# EAGLE schematic master_wiring (EAGLE 9.6.2)
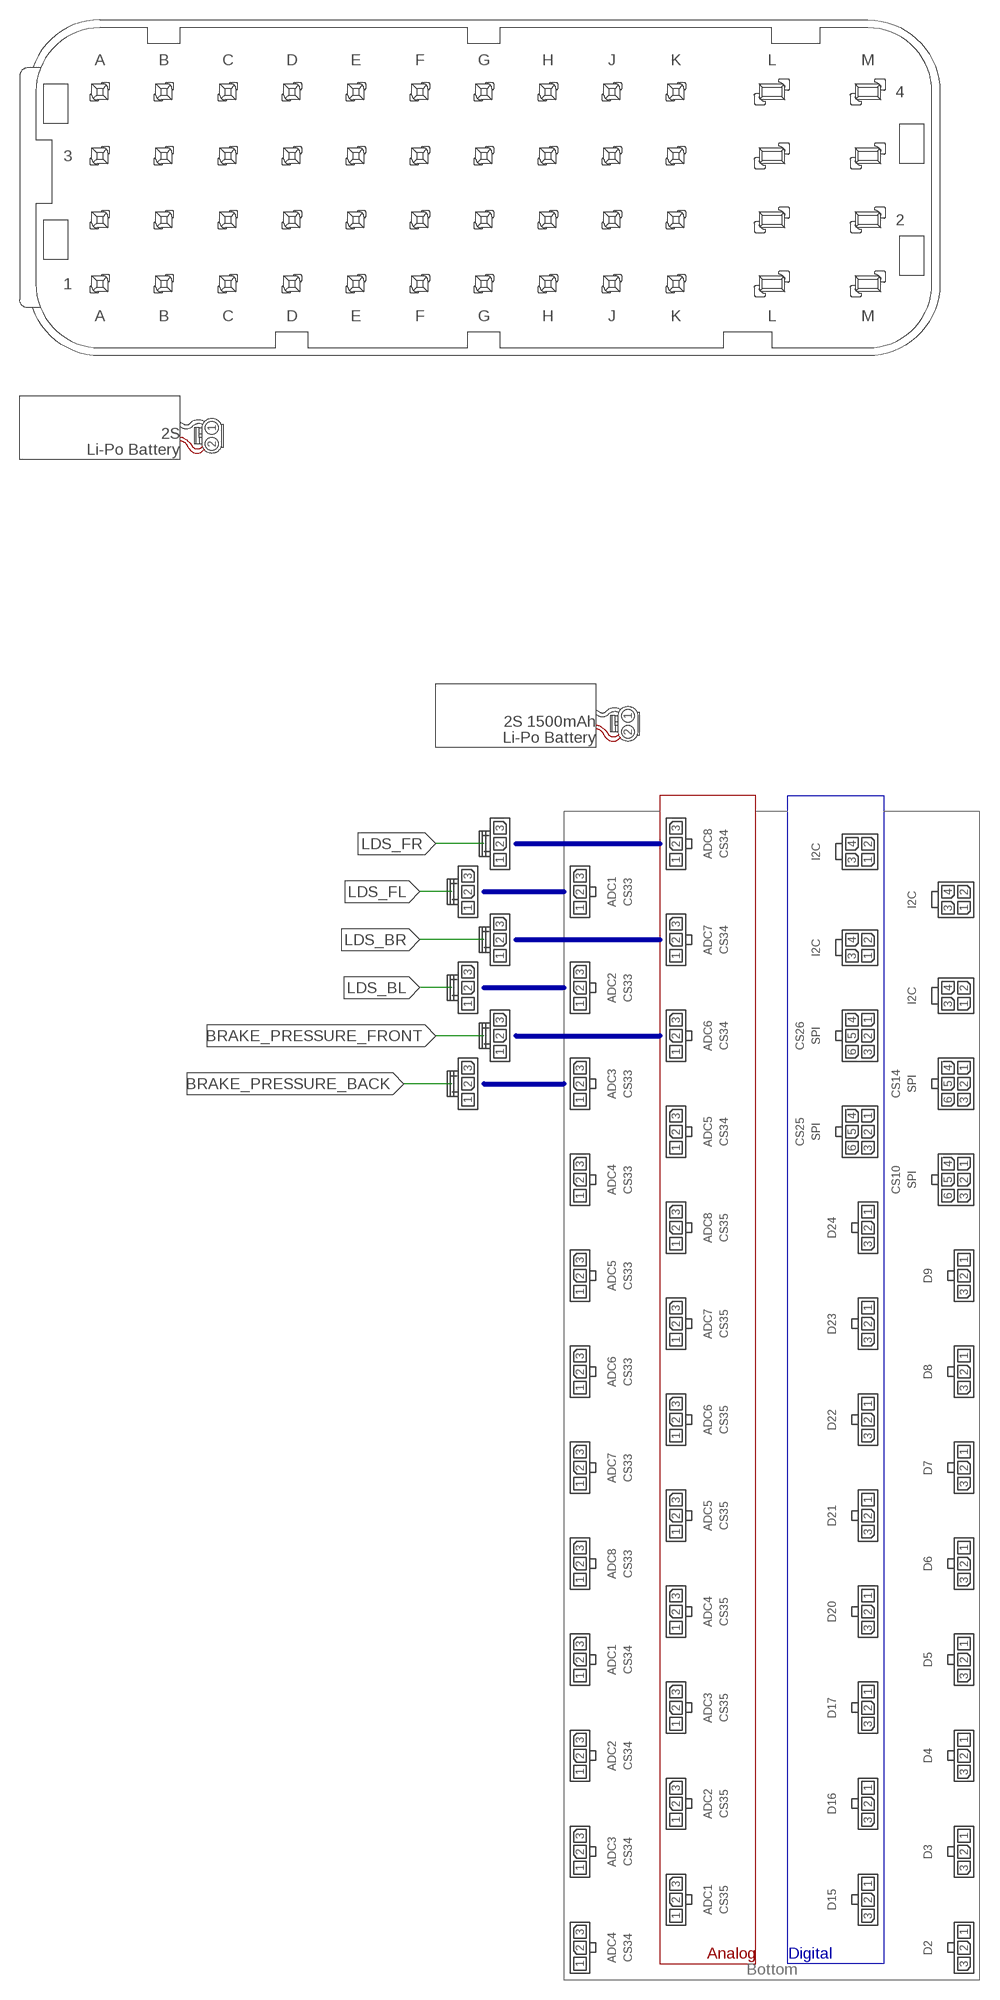
[diagram p0: schematic, sheet 1, part 1 of 2]
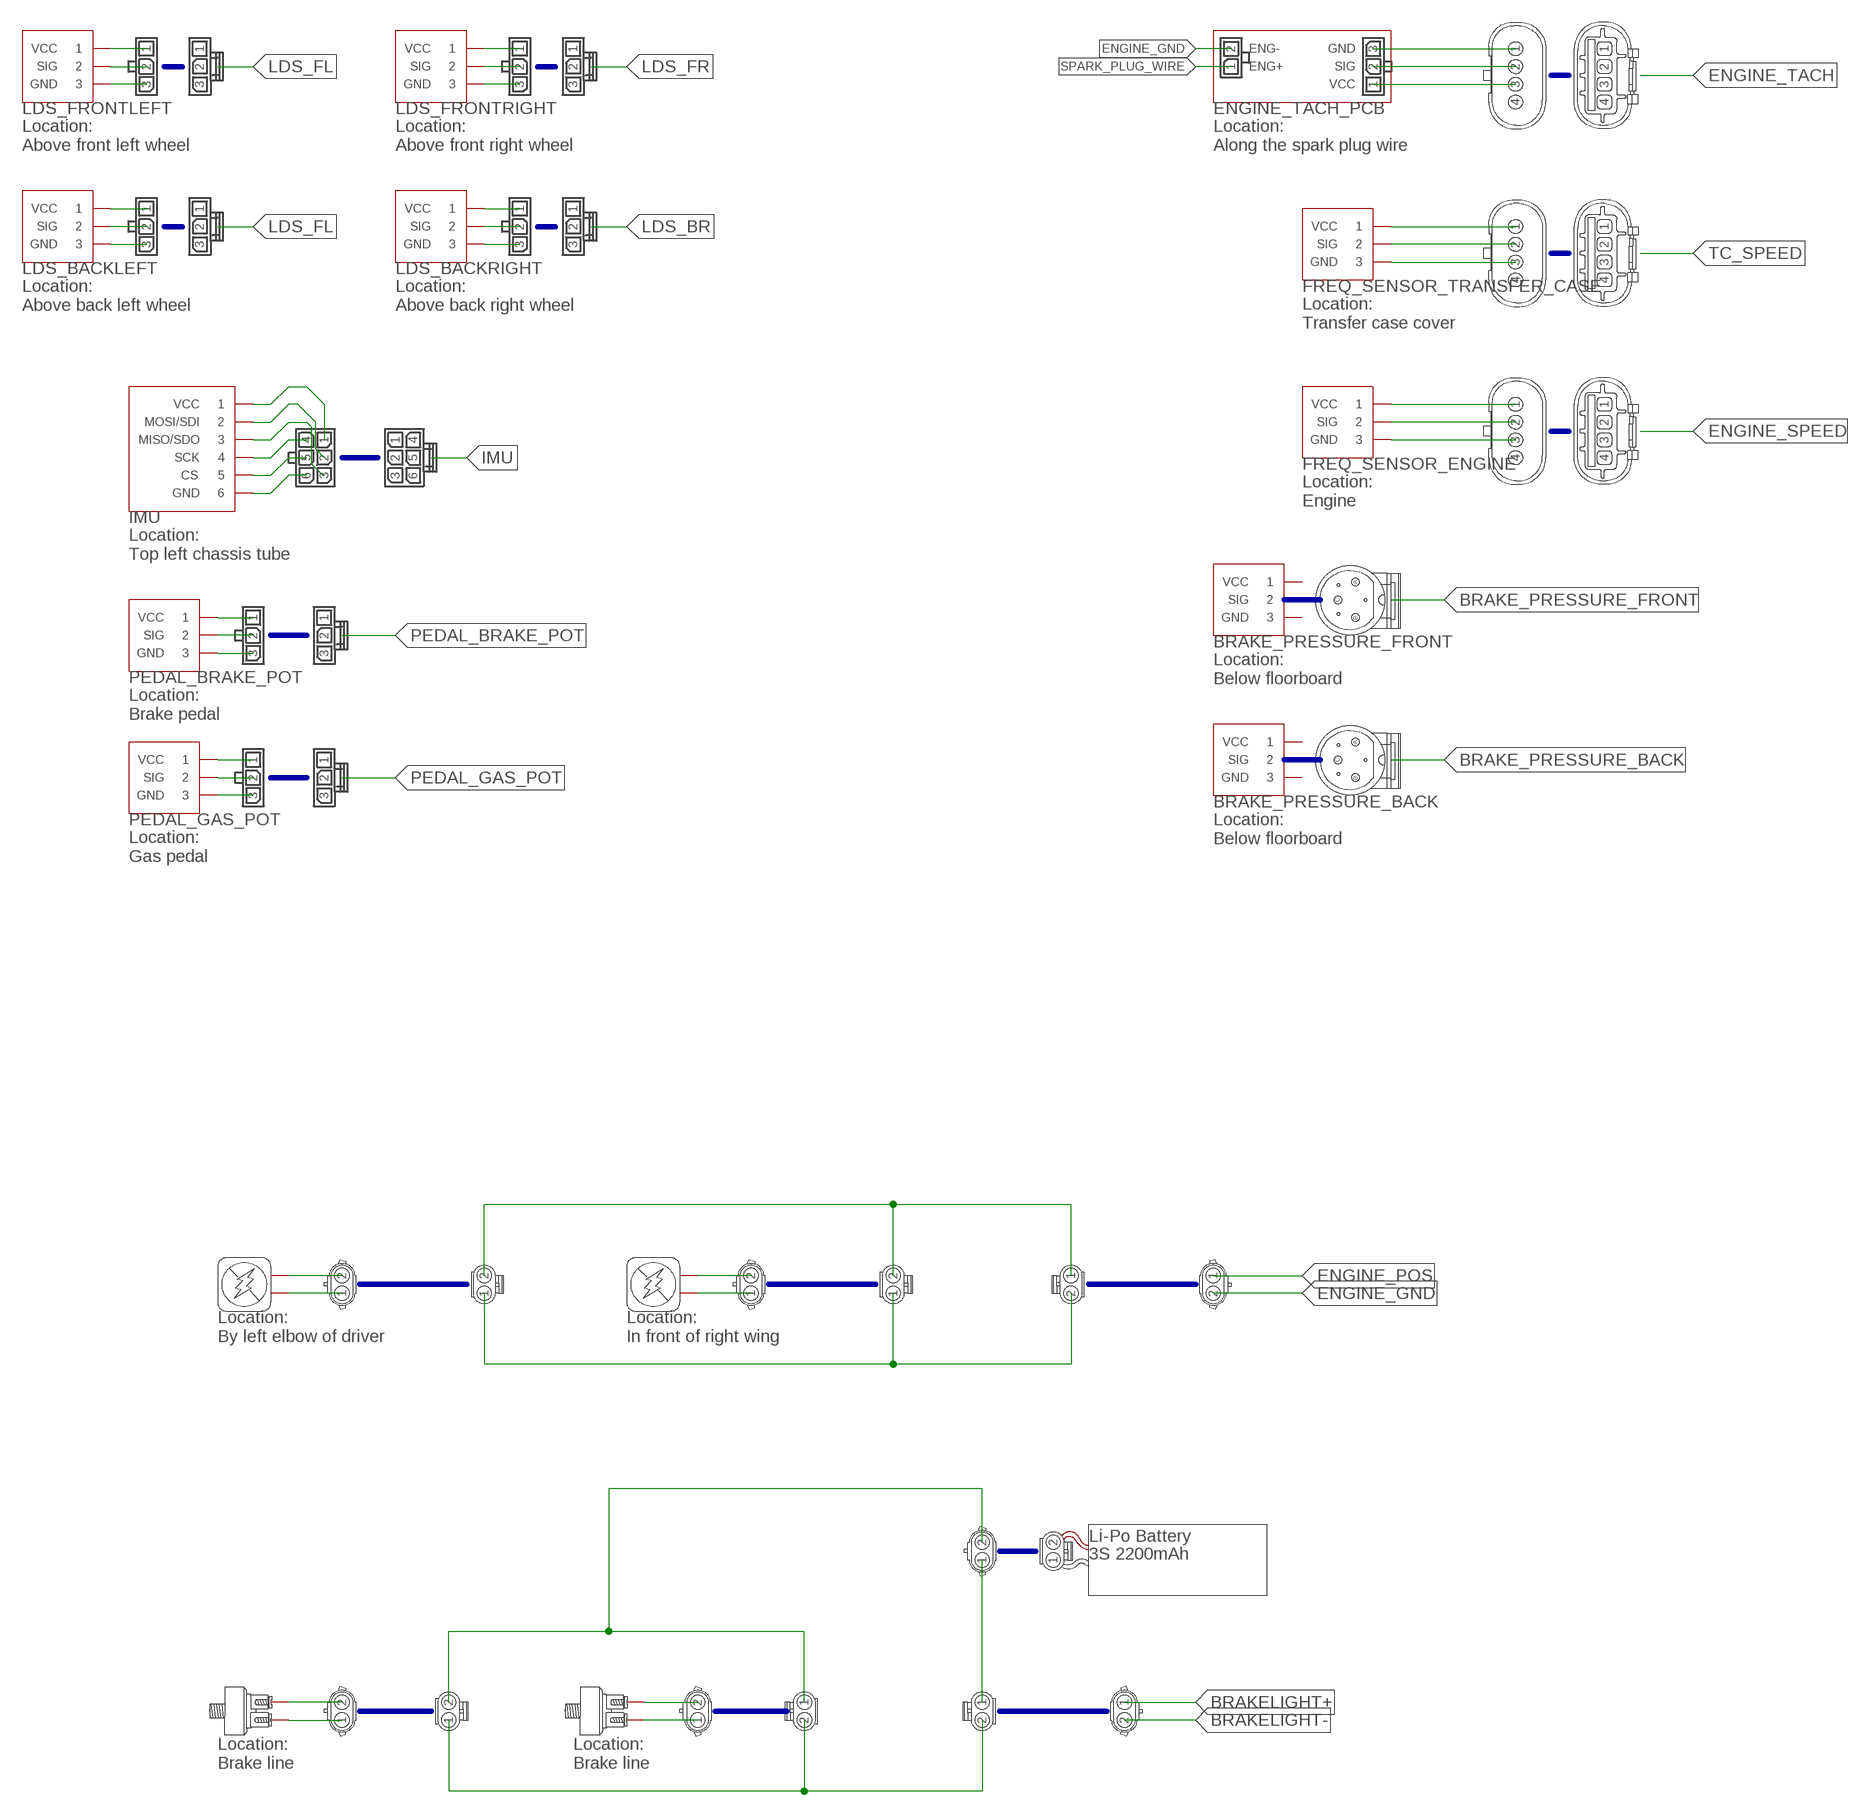
[diagram p1: schematic, sheet 1, part 2 of 2]

## Parts
BRAKE_PRESSURE_BACK  SENSOR_1X3  [PINS_3]
BRAKE_PRESSURE_FRONT  SENSOR_1X3  [PINS_3]
ENGINE_TACH_PCB  ENGINE_TACH_PCB  [PINS_7]
FREQ_SENSOR_ENGINE  SENSOR_1X3  [PINS_3]
FREQ_SENSOR_TRANSFER_CASE  SENSOR_1X3  [PINS_3]
IMU  SENSOR_SPI_2X3  [PINS_7]
LDS_BACKLEFT  SENSOR_1X3  [PINS_3]
LDS_BACKRIGHT  SENSOR_1X3  [PINS_3]
LDS_FRONTLEFT  SENSOR_1X3  [PINS_3]
LDS_FRONTRIGHT  SENSOR_1X3  [PINS_3]
PEDAL_BRAKE_POT  SENSOR_1X3  [PINS_3]
PEDAL_GAS_POT  SENSOR_1X3  [PINS_3]
U$1  MICROFIT_1X3_MALE  [PINS_4]
U$2  CMC_48PIN_PLUG_PCB  [PINS_49]
U$3  AUXDAQ_REV2  [PINS_200]
U$4  SKIDOO_KILLSWITCH  [PINS_3]
U$5  WEATHERPACK_1X2_MALE  [PINS_3]
U$6  WEATHERPACK_1X2_FEMALE  [PINS_3]
U$7  WEATHERPACK_1X2_MALE  [PINS_3]
U$8  WEATHERPACK_1X2_MALE  [PINS_3]
U$9  SKIDOO_KILLSWITCH  [PINS_3]
U$10  WEATHERPACK_1X2_FEMALE  [PINS_3]
U$11  WEATHERPACK_1X2_FEMALE  [PINS_3]
U$12  BRAKELIGHT_SWITCH_HYDRAULIC  [PINS_3]
U$13  WEATHERPACK_1X2_MALE  [PINS_3]
U$14  MICROFIT_1X3_MALE  [PINS_4]
U$15  WEATHERPACK_1X2_FEMALE  [PINS_3]
U$16  WEATHERPACK_1X2_MALE  [PINS_3]
U$17  WEATHERPACK_1X2_MALE  [PINS_3]
U$18  BRAKELIGHT_SWITCH_HYDRAULIC  [PINS_3]
U$19  WEATHERPACK_1X2_FEMALE  [PINS_3]
U$20  WEATHERPACK_1X2_FEMALE  [PINS_3]
U$21  MICROFIT_1X3_MALE  [PINS_4]
U$22  MICROFIT_1X3_MALE  [PINS_4]
U$23  MICROFIT_2X3_MALE  [PINS_7]
U$24  MICROFIT_1X3_MALE  [PINS_4]
U$25  MICROFIT_1X3_MALE  [PINS_4]
U$26  SQUBA_1X4_MALE  [PINS_5]
U$27  SQUBA_1X4_MALE  [PINS_5]
U$28  SQUBA_1X4_MALE  [PINS_5]
U$29  3S 2200mAh  LIPO_BATT  [PINS_200]
U$30  2S 1500mAh  LIPO_BATT  [PINS_200]
U$31  2S  LIPO_BATT  [PINS_200]
U$32  WEATHERPACK_1X2_MALE  [PINS_3]
U$33  MICROFIT_2X3_FEMALE  [PINS_7]
U$34  SQUBA_1X4_FEMALE  [PINS_5]
U$35  SQUBA_1X4_FEMALE  [PINS_5]
U$36  SQUBA_1X4_FEMALE  [PINS_5]
U$37  MICROFIT_1X3_FEMALE  [PINS_4]
U$38  MICROFIT_1X3_FEMALE  [PINS_4]
U$39  MICROFIT_1X3_FEMALE  [PINS_4]
U$40  MICROFIT_1X3_FEMALE  [PINS_4]
U$41  MICROFIT_1X3_FEMALE  [PINS_4]
U$42  MICROFIT_1X3_FEMALE  [PINS_4]
U$43  MICROFIT_1X3_FEMALE  [PINS_4]
U$44  MICROFIT_1X3_FEMALE  [PINS_4]
U$45  MICROFIT_1X3_FEMALE  [PINS_4]
U$46  MICROFIT_1X3_FEMALE  [PINS_4]
U$47  METRIPACK_3PIN_FEMALE  [PINS_3]
U$48  METRIPACK_3PIN_FEMALE  [PINS_3]
U$49  MICROFIT_1X3_FEMALE  [PINS_4]
U$50  MICROFIT_1X3_FEMALE  [PINS_4]

## Nets
B$1: IMU.P$1 IMU.P$2 IMU.P$3 IMU.P$4 IMU.P$5 IMU.P$6 U$23.P$1 U$23.P$2 U$23.P$3 U$23.P$4 U$23.P$5 U$23.P$6
BRAKELIGHT+: U$16.P$2
BRAKELIGHT-: U$16.P$1
ENGINE_GND: ENGINE_TACH_PCB.P$2 U$7.P$1
ENGINE_POS: U$7.P$2
N$1: U$4.P$2 U$5.P$1
N$2: U$4.P$1 U$5.P$2
N$3: U$8.P$1 U$9.P$2
N$4: U$8.P$2 U$9.P$1
N$5: U$12.P$2 U$17.P$2
N$6: U$12.P$1 U$17.P$1
N$7: U$13.P$1 U$18.P$1
N$8: U$13.P$2 U$18.P$2
N$9: PEDAL_GAS_POT.P$1 U$25.P$1
N$10: PEDAL_GAS_POT.P$2 U$25.P$2
N$11: U$6.P$2 U$10.P$2 U$11.P$1
N$12: PEDAL_GAS_POT.P$3 U$25.P$3
N$13: U$6.P$1 U$10.P$1 U$11.P$2
N$14: PEDAL_BRAKE_POT.P$1 U$24.P$1
N$15: PEDAL_BRAKE_POT.P$2 U$24.P$2
N$16: PEDAL_BRAKE_POT.P$3 U$24.P$3
N$17: LDS_BACKRIGHT.P$1 U$22.P$1
N$18: LDS_BACKRIGHT.P$2 U$22.P$2
N$19: LDS_BACKRIGHT.P$3 U$22.P$3
N$20: U$15.P$1 U$19.P$2 U$32.P$1
N$21: U$15.P$2 U$19.P$1 U$20.P$2
N$22: LDS_FRONTRIGHT.P$3 U$21.P$3
N$23: LDS_FRONTRIGHT.P$2 U$21.P$2
N$24: LDS_FRONTRIGHT.P$1 U$21.P$1
N$25: LDS_FRONTLEFT.P$1 U$1.P$1
N$26: LDS_FRONTLEFT.P$2 U$1.P$2
N$27: LDS_FRONTLEFT.P$3 U$1.P$3
N$28: LDS_BACKLEFT.P$1 U$14.P$1
N$29: LDS_BACKLEFT.P$2 U$14.P$2
N$30: LDS_BACKLEFT.P$3 U$14.P$3
N$31: FREQ_SENSOR_TRANSFER_CASE.P$1 U$28.P$1
N$32: FREQ_SENSOR_TRANSFER_CASE.P$2 U$28.P$2
N$33: FREQ_SENSOR_TRANSFER_CASE.P$3 U$28.P$3
N$34: FREQ_SENSOR_ENGINE.P$1 U$27.P$1
N$35: FREQ_SENSOR_ENGINE.P$2 U$27.P$2
N$36: FREQ_SENSOR_ENGINE.P$3 U$27.P$3
N$37: ENGINE_TACH_PCB.P$3 U$26.P$3
N$38: ENGINE_TACH_PCB.P$4 U$26.P$2
N$39: ENGINE_TACH_PCB.P$5 U$26.P$1
N$40: U$20.P$1 U$32.P$2
SPARK_PLUG_WIRE: ENGINE_TACH_PCB.P$1
Unconnected: BRAKE_PRESSURE_BACK.P$1 BRAKE_PRESSURE_BACK.P$2 BRAKE_PRESSURE_BACK.P$3 BRAKE_PRESSURE_FRONT.P$1 BRAKE_PRESSURE_FRONT.P$2 BRAKE_PRESSURE_FRONT.P$3 U$2.P$1(A1) U$2.P$2(A2) U$2.P$3(A3) U$2.P$4(A4) U$2.P$5(B1) U$2.P$6(B2) U$2.P$7(B3) U$2.P$8(B4) U$2.P$9(C1) U$2.P$10(C2) U$2.P$11(C3) U$2.P$12(C4) U$2.P$13(D1) U$2.P$14(D2) U$2.P$15(D3) U$2.P$16(D4) U$2.P$17(E1) U$2.P$18(E2) U$2.P$19(E3) U$2.P$20(E4) U$2.P$21(F1) U$2.P$22(F2) U$2.P$23(F3) U$2.P$24(F4) U$2.P$25(G1) U$2.P$26(G2) U$2.P$27(G3) U$2.P$28(G4) U$2.P$29(H1) U$2.P$30(H2) U$2.P$31(H3) U$2.P$32(H4) U$2.P$33(J1) U$2.P$34(J2) U$2.P$35(J3) U$2.P$36(J4) U$2.P$37(K1) U$2.P$38(K2) U$2.P$39(K3) U$2.P$40(K4) U$3.P$1 U$3.P$2 U$3.P$3 U$3.P$4 U$3.P$5 U$3.P$6 U$3.P$7 U$3.P$8 U$3.P$9 U$3.P$10 U$3.P$11 U$3.P$12 U$3.P$13 U$3.P$14 U$3.P$15 U$3.P$16 U$3.P$17 U$3.P$18 U$3.P$19 U$3.P$20 U$3.P$21 U$3.P$22 U$3.P$23 U$3.P$24 U$3.P$25 U$3.P$26 U$3.P$27 U$3.P$28 U$3.P$29 U$3.P$30 U$3.P$31 U$3.P$32 U$3.P$33 U$3.P$34 U$3.P$35 U$3.P$36 U$3.P$37 U$3.P$38 U$3.P$39 U$3.P$40 U$3.P$41 U$3.P$42 U$3.P$43 U$3.P$44 U$3.P$45 U$3.P$46 U$3.P$47 U$3.P$48 U$3.P$49 U$3.P$50 U$3.P$51 U$3.P$52 U$3.P$53 U$3.P$54 U$3.P$55 U$3.P$56 U$3.P$57 U$3.P$58 U$3.P$59 U$3.P$60 U$3.P$61 U$3.P$62 U$3.P$63 U$3.P$64 U$3.P$65 U$3.P$66 U$3.P$67 U$3.P$68 U$3.P$69 U$3.P$70 U$3.P$71 U$3.P$72 U$3.P$73 U$3.P$74 U$3.P$75 U$3.P$76 U$3.P$77 U$3.P$78 U$3.P$79 U$3.P$80 U$3.P$81 U$3.P$82 U$3.P$83 U$3.P$84 U$3.P$85 U$3.P$86 U$3.P$87 U$3.P$88 U$3.P$89 U$3.P$90 U$3.P$91 U$3.P$92 U$3.P$93 U$3.P$94 U$3.P$95 U$3.P$96 U$3.P$97 U$3.P$98 U$3.P$99 U$3.P$100 U$3.P$101 U$3.P$102 U$3.P$103 U$3.P$104 U$3.P$105 U$3.P$106 U$3.P$107 U$3.P$108 U$3.P$109 U$3.P$110 U$3.P$111 U$3.P$112 U$3.P$113 U$3.P$114 U$3.P$115 U$3.P$116 U$3.P$117 U$3.P$118 U$3.P$119 U$3.P$120 U$3.P$121 U$3.P$122 U$3.P$123 U$3.P$124 U$3.P$125 U$3.P$126 U$3.P$127 U$3.P$128 U$3.P$129 U$3.P$130 U$3.P$131 U$3.P$132 U$3.P$133 U$3.P$134 U$3.P$135 U$3.P$136 U$3.P$137 U$3.P$138 U$3.P$139 U$3.P$140 U$3.P$141 U$3.P$142 U$3.P$143 U$3.P$144 U$3.P$145 U$3.P$146 U$3.P$147 U$3.P$148 U$3.P$149 U$3.P$150 U$3.P$151 U$3.P$152 U$3.P$153 U$3.P$154 U$3.P$155 U$3.P$156 U$3.P$157 U$3.P$158 U$3.P$159 U$3.P$160 U$26.P$4 U$27.P$4 U$28.P$4 U$29.P$1 U$29.P$2 U$30.P$1 U$30.P$2 U$31.P$1 U$31.P$2 U$33.P$1 U$33.P$2 U$33.P$3 U$33.P$4 U$33.P$5 U$33.P$6 U$34.P$1 U$34.P$2 U$34.P$3 U$34.P$4 U$35.P$1 U$35.P$2 U$35.P$3 U$35.P$4 U$36.P$1 U$36.P$2 U$36.P$3 U$36.P$4 U$37.P$1 U$37.P$2 U$37.P$3 U$38.P$1 U$38.P$2 U$38.P$3 U$39.P$1 U$39.P$2 U$39.P$3 U$40.P$1 U$40.P$2 U$40.P$3 U$41.P$1 U$41.P$2 U$41.P$3 U$42.P$1 U$42.P$2 U$42.P$3 U$43.P$1 U$43.P$2 U$43.P$3 U$44.P$1 U$44.P$2 U$44.P$3 U$45.P$1 U$45.P$2 U$45.P$3 U$46.P$1 U$46.P$2 U$46.P$3 U$47.P$1 U$47.P$2 U$47.P$3 U$48.P$1 U$48.P$2 U$48.P$3 U$49.P$1 U$49.P$2 U$49.P$3 U$50.P$1 U$50.P$2 U$50.P$3

## Buses
B$8
B$9
B$10
B$11
B$12
B$2
B$3
B$1
B$4
B$5
B$6
B$13
B$14
B$15
B$16
B$17
B$18
B$7
B$19
B$20
B$21
BRAKE_PRESSURE_FRONT
B$22
B$23

## Notes on the sheet
- Location:
  Above front left wheel
- Location:
  Above front right wheel
- Location:
  Along the spark plug wire
- Location:
  Above back left wheel
- Location:
  Above back right wheel
- Location:
  Transfer case cover
- Location:
  Engine
- Location:
  Top left chassis tube
- Location:
  Below floorboard
- Location:
  Brake pedal
- Location:
  Below floorboard
- Location:
  Gas pedal
- Location:
  By left elbow of driver
- Location:
  In front of right wing
- Location:
  Brake line
- Location:
  Brake line

## Power pins joined to a net without a drawn wire
L1: U$2.P$41(L1)
L2: U$2.P$42(L2)
L3: U$2.P$43(L3)
L4: U$2.P$44(L4)
M1: U$2.P$45(M1)
M2: U$2.P$46(M2)
M3: U$2.P$47(M3)
M4: U$2.P$48(M4)

## Library data of the parts
BRAKE_PRESSURE_BACK BRAKE_PRESSURE_FRONT FREQ_SENSOR_ENGINE FREQ_SENSOR_TRANSFER_CASE LDS_BACKLEFT LDS_BACKRIGHT LDS_FRONTLEFT LDS_FRONTRIGHT PEDAL_BRAKE_POT PEDAL_GAS_POT = wiring:SENSOR_1X3
ENGINE_TACH_PCB = wiring:ENGINE_TACH_PCB
IMU = wiring:SENSOR_SPI_2X3
U$1 U$14 U$21 U$22 U$24 U$25 = wiring:MICROFIT_1X3_MALE: "Description: 3 pin Molex Micro-Fit plug connector Manufacturer Part Number: 436400301 Manufacturer: Molex Vendor: Digikey Rows: 1 Pins: 3 Crimp Type: Male Waterproof: No Item URL: https://www.digikey.com/en/products/detail/molex/0436400301/268985"
U$2 = wiring:CMC_48PIN_PLUG_PCB: "Description: 48 Pin CMC plug connector (PCB through-hole) (40 signal 8 power) Manufacturer Part Number: 366380003 Manufacturer: Molex Vendor: Digikey Rows: 4 Pins: 48 Crimp Type: Male Waterproof: Yes Item URL: https://www.digikey.com/en/products/detail/molex/0366380003/2523207?s=N4IgTCBcDaIMwDYFwBwAYNxAXQL5A"
U$3 = wiring:AUXDAQ_REV2
U$4 U$9 = wiring:SKIDOO_KILLSWITCH
U$5 U$7 U$8 U$13 U$16 U$17 U$32 = wiring:WEATHERPACK_1X2_MALE: "Description: 2-pin Weather-Pack male connector Manufacturer Part Number: 12010973 Manufacturer: Aptiv Vendor: Waytek Rows: 1 Pins: 2 Crimp Type: Male Waterproof: Yes Item URL: https://www.waytekwire.com/item/38042/Aptiv-12010973-Male-2-Contact-Shroud-Half/"
U$6 U$10 U$11 U$15 U$19 U$20 = wiring:WEATHERPACK_1X2_FEMALE: "Description: 2-pin Weather-Pack female connector Manufacturer Part Number: 12015792 Manufacturer: Aptiv Vendor: Waytek Rows: 1 Pins: 2 Crimp Type: Female Waterproof: Yes Item URL: https://www.waytekwire.com/item/38043/Aptiv-12015792-Female-2-Contact-Tower-Half-Body/"
U$12 U$18 = wiring:BRAKELIGHT_SWITCH_HYDRAULIC
U$23 = wiring:MICROFIT_2X3_MALE: "Description: 6 pin Molex Micro-Fit plug connector Manufacturer Part Number: 430200601 Manufacturer: Molex Vendor: Digikey Rows: 2 Pins: 6 Crimp Type: Male Waterproof: No Item URL: https://www.digikey.com/en/products/detail/molex/0430200601/1132438"
U$26-U$28 = wiring:SQUBA_1X4_MALE
U$29-U$31 = wiring:LIPO_BATT
U$33 = wiring:MICROFIT_2X3_FEMALE: "Description: 6 pin Molex Micro-Fit receptacle connector Manufacturer Part Number: 430250600 Manufacturer: Molex Vendor: Digikey Rows: 2 Pins: 6 Crimp Type: Female Waterproof: No Item URL: https://www.digikey.com/en/products/detail/molex/0430250600/252498"
U$34-U$36 = wiring:SQUBA_1X4_FEMALE
U$37-U$46 U$49 U$50 = wiring:MICROFIT_1X3_FEMALE: "Description: 3 pin Molex Micro-Fit receptacle connector Manufacturer Part Number: 436450300 Manufacturer: Molex Vendor: Digikey Rows: 1 Pins: 3 Crimp Type: Female Waterproof: No Item URL: https://www.digikey.com/en/products/detail/molex/0436450300/268975"
U$47 U$48 = wiring:METRIPACK_3PIN_FEMALE